# EAGLE schematic RTC7seg (EAGLE 6.5.0)
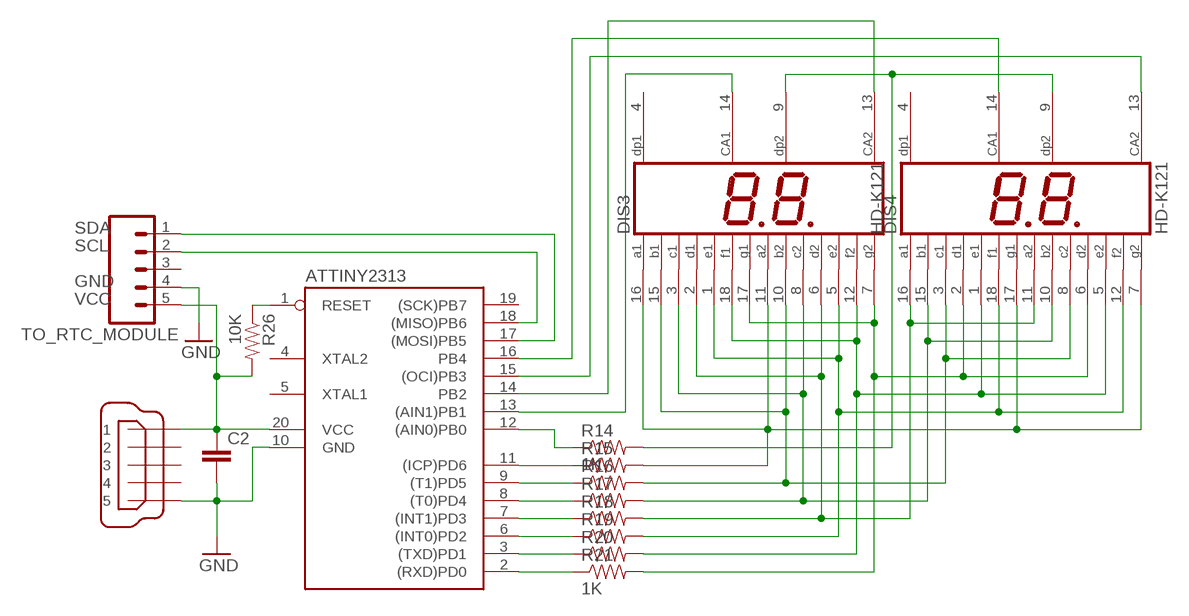
[diagram p0: schematic, sheet 1]

## Parts
ATTINY2313  AT90S2313P  [DIL20]
C2  CAPPTH2  [CAP-PTH-SMALL2]
DIS3  HD-K121  [HDSP-R]
DIS4  HD-K121  [HDSP-R]
R14  1K  RESISTORPTH-1/4W  [AXIAL-0.4]
R15  RESISTORPTH-1/4W  [AXIAL-0.4]
R16  RESISTORPTH-1/4W  [AXIAL-0.4]
R17  RESISTORPTH-1/4W  [AXIAL-0.4]
R18  RESISTORPTH-1/4W  [AXIAL-0.4]
R19  RESISTORPTH-1/4W  [AXIAL-0.4]
R20  RESISTORPTH-1/4W  [AXIAL-0.4]
R21  1K  RESISTORPTH-1/4W  [AXIAL-0.4]
R26  10K  RESISTORPTH-1/4W  [AXIAL-0.4]
TO_RTC_MODULE  M05PTH  [1X05]
X1  MINI-USB-UX60-MB-5S8  [UX60-MB-5S8]

## Nets
GND: ATTINY2313.10(GND) C2.2 TO_RTC_MODULE.4 X1.5
N$1: DIS3.9(DP2) DIS4.9(DP2) R14.P$2
N$2: ATTINY2313.12((AIN0)PB0) R14.P$1
N$6: DIS3.2(D1) DIS3.3(C1) DIS3.6(D2) DIS3.8(C2) DIS4.10(B2) DIS4.11(A2) DIS4.15(B1) DIS4.16(A1) R17.P$2 R18.P$2
N$8: DIS3.10(B2) DIS3.15(B1)
N$9: DIS3.7(G2) DIS3.17(G1) DIS4.2(D1) DIS4.6(D2) R21.P$2
N$10: DIS3.11(A2) DIS3.16(A1)
N$41: ATTINY2313.2((RXD)PD0) R21.P$1
N$42: ATTINY2313.3((TXD)PD1) R20.P$1
N$43: ATTINY2313.6((INT0)PD2) R19.P$1
N$44: ATTINY2313.7((INT1)PD3) R18.P$1
N$45: ATTINY2313.8((T0)PD4) R17.P$1
N$46: ATTINY2313.9((T1)PD5) R16.P$1
N$47: ATTINY2313.11((ICP)PD6) R15.P$1
N$49: ATTINY2313.13((AIN1)PB1) DIS3.14(CA1)
N$50: ATTINY2313.14(PB2) DIS3.13(CA2)
N$51: ATTINY2313.15((OCI)PB3) DIS4.13(CA2)
N$52: ATTINY2313.16(PB4) DIS4.14(CA1)
N$55: ATTINY2313.1(RESET) R26.P$1
N$56: DIS3.12(F2) DIS3.18(F1) DIS4.1(E1) DIS4.5(E2) R20.P$2
N$57: DIS3.1(E1) DIS3.5(E2) DIS4.12(F2) DIS4.18(F1) R19.P$2
N$59: DIS4.3(C1) DIS4.8(C2) R16.P$2
N$60: DIS4.7(G2) DIS4.17(G1) R15.P$2
SCL: ATTINY2313.18((MISO)PB6) TO_RTC_MODULE.2
SDA: ATTINY2313.17((MOSI)PB5) TO_RTC_MODULE.1
VCC: ATTINY2313.20(VCC) C2.1 R26.P$2 TO_RTC_MODULE.5 X1.1
Unconnected: ATTINY2313.4(XTAL2) ATTINY2313.5(XTAL1) ATTINY2313.19((SCK)PB7) DIS3.4(DP1) DIS4.4(DP1) TO_RTC_MODULE.3 X1.2 X1.3 X1.4

## Library data of the parts
ATTINY2313 = atmel:AT90S2313: MICROCONTROLLER 2 Kbytes FLASH 128 bytes SRAM 128 bytes EEPROM UART
C2 = SparkFun:CAP: Capacitor Standard 0603 ceramic capacitor, and 0.1" leaded capacitor.
DIS3 DIS4 = display-hp:HD-K121: LED DISPLAY 2 x 1 character 7 segment, decimal points right
R14-R21 R26 = SparkFun:RESISTOR: Resistor Basic schematic elements and footprints for 0603, 1206, and PTH resistors.
TO_RTC_MODULE = SparkFun:M05: Header 5 Standard 5-pin 0.1" header. Use with straight break away headers (SKU : PRT-00116), right angle break away headers (PRT-00553), swiss pins (PRT-00743), machine pins (PRT-00117), and female headers (PRT-00115). Molex polarized connector foot print use with SKU : PRT-08230 with associated crimp pins and housings.
X1 = con-hirose:MINI-USB-: MINI USB Connector Source: http://www.hirose.co.jp/cataloge_hp/e24000019.pdf